# Altium schematic sheet DC_controller.SchDoc
size A
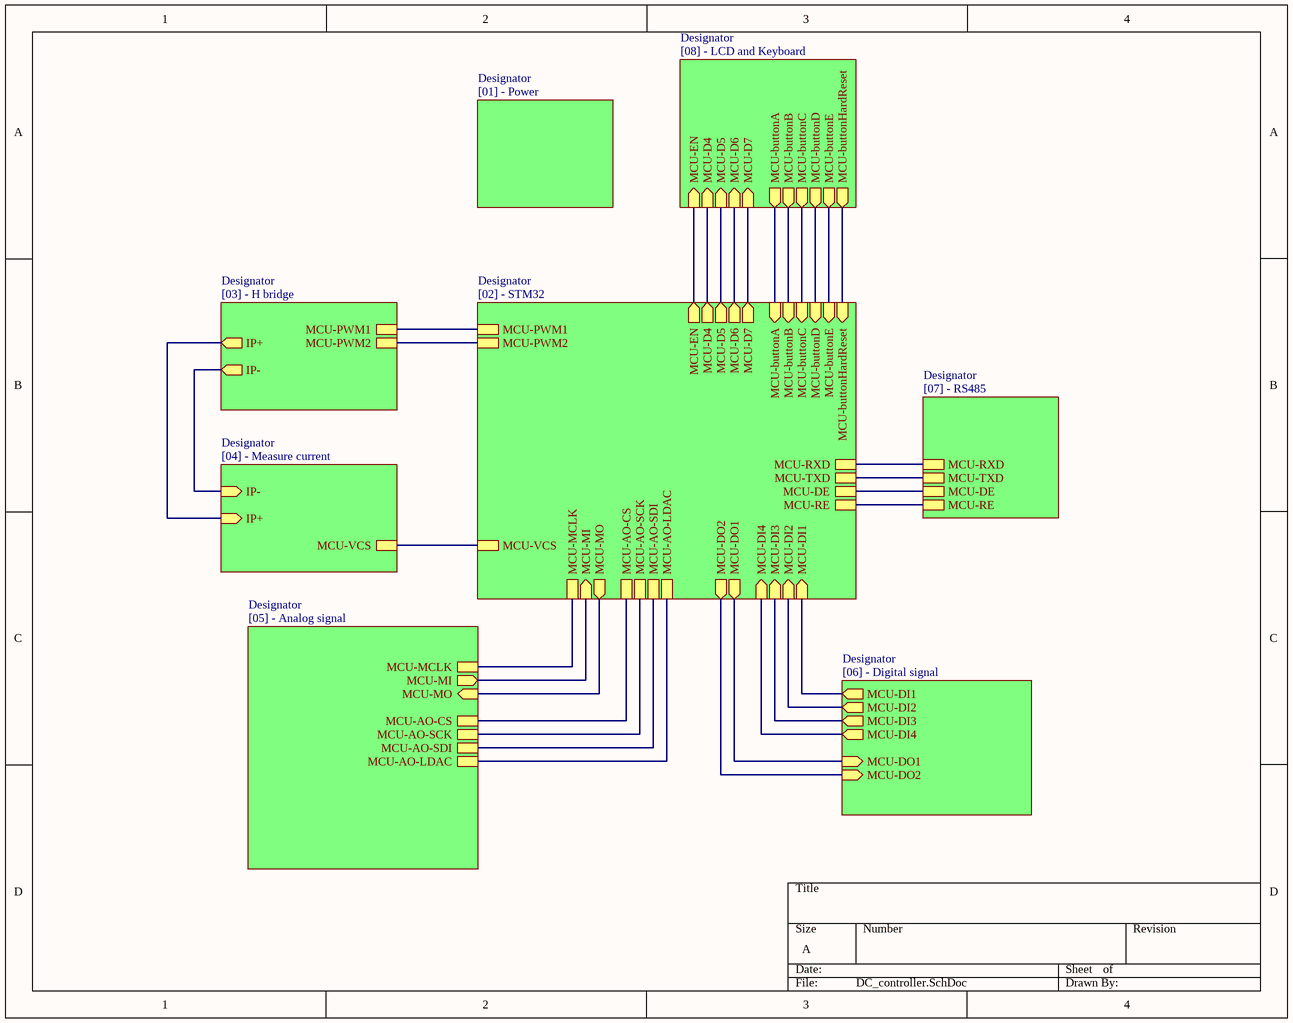
[diagram p0: DC_controller.SchDoc]

## Sub-sheets
Designator = [01] - Power: no entries
Designator = [02] - STM32: MCU-DI1 (in), MCU-DI2 (in), MCU-DO1 (out), MCU-DO2 (out), MCU-EN (out), MCU-D4 (out), MCU-D5 (out), MCU-D6 (out), MCU-D7 (out), MCU-buttonA (in), MCU-RE, MCU-DE, MCU-TXD, MCU-RXD, MCU-VCS, MCU-MCLK, MCU-MI (in), MCU-MO (out), MCU-AO-CS, MCU-AO-SCK, MCU-AO-SDI, MCU-AO-LDAC, MCU-PWM1, MCU-PWM2, MCU-DI3 (in), MCU-DI4 (in), MCU-buttonB (in), MCU-buttonC (in), MCU-buttonD (in), MCU-buttonE (in), MCU-buttonHardReset (in)
Designator = [05] - Analog signal: MCU-MCLK, MCU-MI (out), MCU-MO (in), MCU-AO-CS, MCU-AO-SCK, MCU-AO-SDI, MCU-AO-LDAC
Designator = [03] - H bridge: IP+ (out), IP- (out), MCU-PWM1, MCU-PWM2
Designator = [07] - RS485: MCU-RE, MCU-DE, MCU-TXD, MCU-RXD
Designator = [04] - Measure current: IP- (in), IP+ (in), MCU-VCS
Designator = [06] - Digital signal: MCU-DI1 (out), MCU-DI2 (out), MCU-DO1 (in), MCU-DO2 (in), MCU-DI3 (out), MCU-DI4 (out)
Designator = [08] - LCD and Keyboard: MCU-EN (in), MCU-D4 (in), MCU-D5 (in), MCU-D6 (in), MCU-D7 (in), MCU-buttonA (out), MCU-buttonB (out), MCU-buttonC (out), MCU-buttonD (out), MCU-buttonE (out), MCU-buttonHardReset (out)

## Nets
(unnamed): sheet Designator/MCU-DI1, sheet Designator/MCU-DI1
(unnamed): sheet Designator/MCU-DI2, sheet Designator/MCU-DI2
(unnamed): sheet Designator/MCU-DO1, sheet Designator/MCU-DO1
(unnamed): sheet Designator/MCU-DO2, sheet Designator/MCU-DO2
(unnamed): sheet Designator/MCU-EN, sheet Designator/MCU-EN
(unnamed): sheet Designator/MCU-D4, sheet Designator/MCU-D4
(unnamed): sheet Designator/MCU-D5, sheet Designator/MCU-D5
(unnamed): sheet Designator/MCU-D6, sheet Designator/MCU-D6
(unnamed): sheet Designator/MCU-D7, sheet Designator/MCU-D7
(unnamed): sheet Designator/MCU-buttonA, sheet Designator/MCU-buttonA
(unnamed): sheet Designator/MCU-RE, sheet Designator/MCU-RE
(unnamed): sheet Designator/MCU-DE, sheet Designator/MCU-DE
(unnamed): sheet Designator/MCU-TXD, sheet Designator/MCU-TXD
(unnamed): sheet Designator/MCU-RXD, sheet Designator/MCU-RXD
(unnamed): sheet Designator/MCU-VCS, sheet Designator/MCU-VCS
(unnamed): sheet Designator/MCU-MCLK, sheet Designator/MCU-MCLK
(unnamed): sheet Designator/MCU-MI, sheet Designator/MCU-MI
(unnamed): sheet Designator/MCU-MO, sheet Designator/MCU-MO
(unnamed): sheet Designator/MCU-AO-CS, sheet Designator/MCU-AO-CS
(unnamed): sheet Designator/MCU-AO-SCK, sheet Designator/MCU-AO-SCK
(unnamed): sheet Designator/MCU-AO-SDI, sheet Designator/MCU-AO-SDI
(unnamed): sheet Designator/MCU-AO-LDAC, sheet Designator/MCU-AO-LDAC
(unnamed): sheet Designator/MCU-PWM1, sheet Designator/MCU-PWM1
(unnamed): sheet Designator/MCU-PWM2, sheet Designator/MCU-PWM2
(unnamed): sheet Designator/MCU-DI3, sheet Designator/MCU-DI3
(unnamed): sheet Designator/MCU-DI4, sheet Designator/MCU-DI4
(unnamed): sheet Designator/MCU-buttonB, sheet Designator/MCU-buttonB
(unnamed): sheet Designator/MCU-buttonC, sheet Designator/MCU-buttonC
(unnamed): sheet Designator/MCU-buttonD, sheet Designator/MCU-buttonD
(unnamed): sheet Designator/MCU-buttonE, sheet Designator/MCU-buttonE
(unnamed): sheet Designator/MCU-buttonHardReset, sheet Designator/MCU-buttonHardReset
(unnamed): sheet Designator/IP+, sheet Designator/IP+
(unnamed): sheet Designator/IP-, sheet Designator/IP-